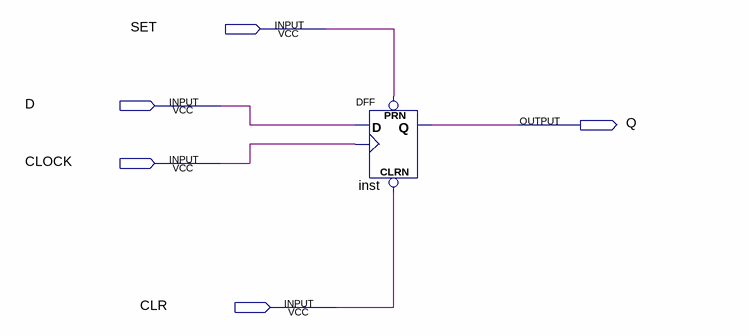
[diagram p0: schematic sheet]
// Quartus schematic Exercise4.bdf as structural Verilog: 1 symbols, 5 pins
module Exercise4 (
  input  SET,
  input  D,
  input  CLOCK,
  input  CLR,
  output Q
);

  DFF inst (.CLRN(CLR), .CLK(CLOCK), .D(D), .PRN(SET), .Q(Q));
endmodule
